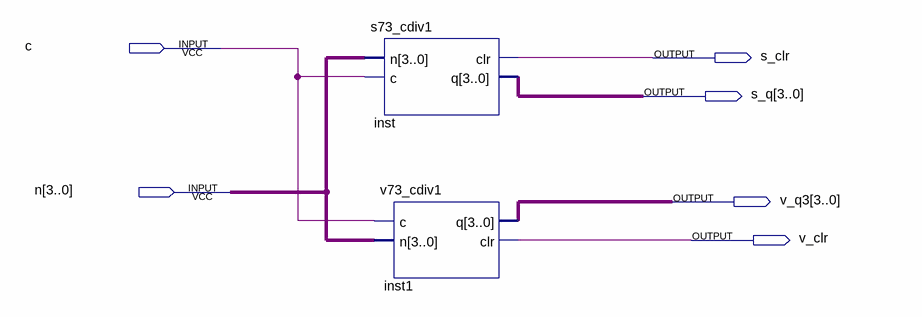
[diagram p0: schematic sheet]
// Quartus schematic sv73_cdiv1.bdf as structural Verilog: 2 symbols, 6 pins
module sv73_cdiv1 (
  input  c,
  input  [3:0] n,
  output s_clr,
  output [3:0] s_q,
  output [3:0] v_q3,
  output v_clr
);

  s73_cdiv1 inst (.n(n), .c(c), .clr(s_clr), .q(s_q));
  v73_cdiv1 inst1 (.c(c), .n(n), .q(v_q3), .clr(v_clr));
endmodule
